# EasyEDA Pro project STM32F103RCT6扩展板.eprj

# Schematic Schematic7
Create Date: 2024-06-12; Page Name: P1; Project Name: 飞协; Schematic Name: Schematic7; Update Date: 2024-06-13; Company: 嘉立创EDA; Page Size: A4; Version: V1.0
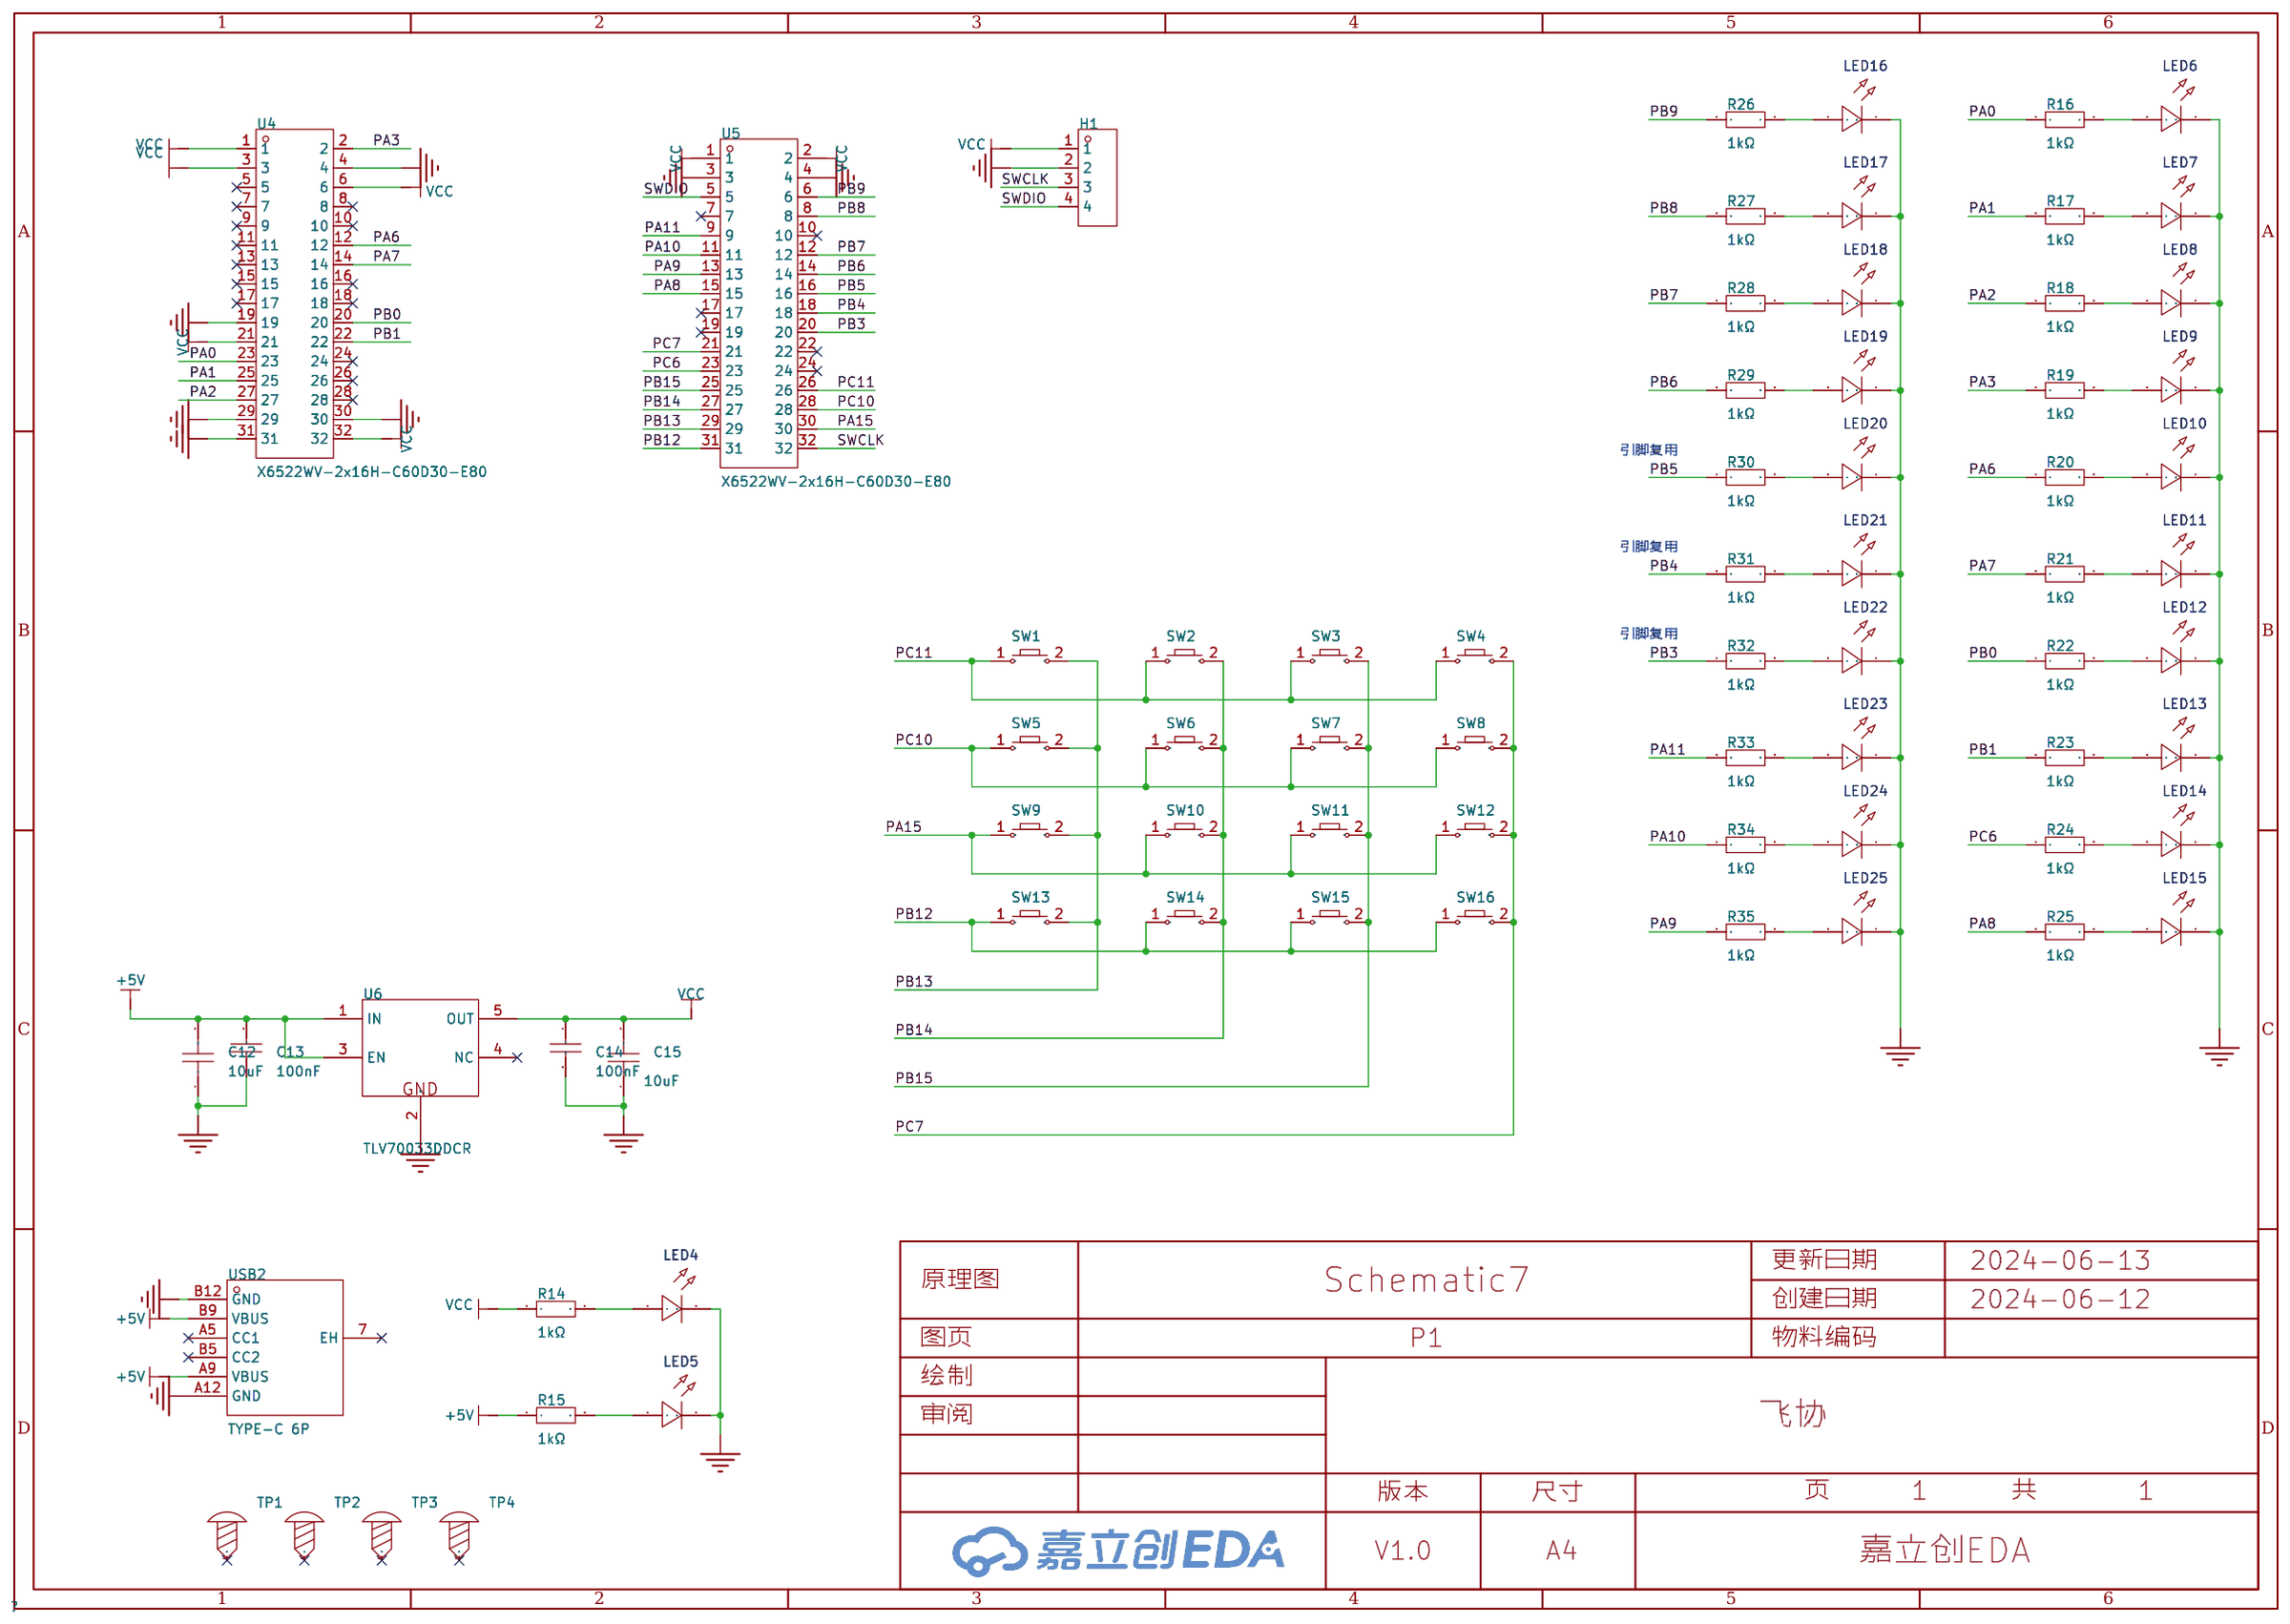
[diagram p0: schematic sheet]

## Parts
C12  10uF  [C0805]
C13  100nF  [C0805]
C14  100nF  [C0805]
C15  10uF  [C0805]
H1  -  [HDR-TH_4P-P2.54-V-F]
LED4  -  [LED_0805]
LED5  -  [LED_0805]
LED6  -  [LED_0805]
LED7  -  [LED_0805]
LED8  -  [LED_0805]
LED9  -  [LED_0805]
LED10  -  [LED_0805]
LED11  -  [LED_0805]
LED12  -  [LED_0805]
LED13  -  [LED_0805]
LED14  -  [LED_0805]
LED15  -  [LED_0805]
LED16  -  [LED_0805]
LED17  -  [LED_0805]
LED18  -  [LED_0805]
LED19  -  [LED_0805]
LED20  -  [LED_0805]
LED21  -  [LED_0805]
LED22  -  [LED_0805]
LED23  -  [LED_0805]
LED24  -  [LED_0805]
LED25  -  [LED_0805]
R14  1kΩ  [R0805]
R15  1kΩ  [R0805]
R16  1kΩ  [R0805]
R17  1kΩ  [R0805]
R18  1kΩ  [R0805]
R19  1kΩ  [R0805]
R20  1kΩ  [R0805]
R21  1kΩ  [R0805]
R22  1kΩ  [R0805]
R23  1kΩ  [R0805]
R24  1kΩ  [R0805]
R25  1kΩ  [R0805]
R26  1kΩ  [R0805]
R27  1kΩ  [R0805]
R28  1kΩ  [R0805]
R29  1kΩ  [R0805]
R30  1kΩ  [R0805]
R31  1kΩ  [R0805]
R32  1kΩ  [R0805]
R33  1kΩ  [R0805]
R34  1kΩ  [R0805]
R35  1kΩ  [R0805]
SW1  -  [Key_SMD_3.6x6.1x2.5]
SW2  -  [Key_SMD_3.6x6.1x2.5]
SW3  -  [Key_SMD_3.6x6.1x2.5]
SW4  -  [Key_SMD_3.6x6.1x2.5]
SW5  -  [Key_SMD_3.6x6.1x2.5]
SW6  -  [Key_SMD_3.6x6.1x2.5]
SW7  -  [Key_SMD_3.6x6.1x2.5]
SW8  -  [Key_SMD_3.6x6.1x2.5]
SW9  -  [Key_SMD_3.6x6.1x2.5]
SW10  -  [Key_SMD_3.6x6.1x2.5]
SW11  -  [Key_SMD_3.6x6.1x2.5]
SW12  -  [Key_SMD_3.6x6.1x2.5]
SW13  -  [Key_SMD_3.6x6.1x2.5]
SW14  -  [Key_SMD_3.6x6.1x2.5]
SW15  -  [Key_SMD_3.6x6.1x2.5]
SW16  -  [Key_SMD_3.6x6.1x2.5]
TP1  -  [M3螺丝]
TP2  -  [M3螺丝]
TP3  -  [M3螺丝]
TP4  -  [M3螺丝]
U4  X6522WV-2x16H-C60D30-E80  [HDR-TH_32P-P2.54-V-M-R2-C16-S2.54-3]
U5  X6522WV-2x16H-C60D30-E80  [HDR-TH_32P-P2.54-V-M-R2-C16-S2.54-3]
U6  TLV70033DDCR  [SOT-23-5_L3.0-W1.7-P0.95-LS2.8-BR]
USB2  TYPE-C 6P  [TYPE-C-SMD_TYPE-C-6P]

## Library data of the parts
C12 C15 = CL21A106KAYNNNE_C15850: 容值:10uF;精度:±10%;额定电压:25V;材质(温度系数):X5R;; LCSC Part Name: 10uF ±10% 25V; Supplier Part: C15850; Manufacturer: SAMSUNG(三星); Manufacturer Part: CL21A106KAYNNNE; Supplier Footprint: 0805; JLCPCB Part Class: 基础库; Datasheet: https://atta.szlcsc.com/upload/public/pdf/source/20160103/1457707679302.pdf; Supplier: LCSC; Tolerance: ±10%; Voltage Rated: 25V; Temperature Coefficient: X5R
C13 C14 = 0805B104K500NT: 容值:100nF;精度:±10%;额定电压:50V;材质(温度系数):X7R;; LCSC Part Name: 100nF ±10% 50V; Supplier Part: C38141; Manufacturer: FH(风华); Supplier Footprint: 0805; JLCPCB Part Class: 扩展库; Datasheet: https://atta.szlcsc.com/upload/public/pdf/source/20200305/C486355_26A10D38EF8C2A5C37091D0039909270.pdf; Supplier: LCSC; Tolerance: ±10%; Voltage Rated: 50V; Temperature Coefficient: X7R
H1 = HDR-F_2.54_1x4P: Supplier Part: C2718488; Supplier Footprint: 插件
LED4-LED25 = LED_0805-B: Supplier Footprint: 0805
R14-R35 = 0805W8F1001T5E: 电阻类型:厚膜电阻;阻值:1kΩ;精度:±1%;功率:125mW;最大工作电压:150V;温度系数:±100ppm/℃;; LCSC Part Name: 1kΩ ±1% 125mW 厚膜电阻; Supplier Part: C17513; Manufacturer: UNI-ROYAL(厚声); Supplier Footprint: 0805; JLCPCB Part Class: 基础库; Datasheet: https://atta.szlcsc.com/upload/public/pdf/source/20200306/C422600_1E6D84923E4A46A82E41ADD87F860B5C.pdf; Supplier: LCSC; Type: 厚膜电阻; Tolerance: ±1%; Power(Watts): 125mW; Overload Voltage (Max): 150V; Temperature Coefficient: ±100ppm/℃; Operating Temperature Range: -55℃~+155℃
SW1-SW16 = Key_SMD_3.6x6.1x2.5: Supplier Footprint: SMD
TP1-TP4 = M3螺丝: Supplier Footprint: 插件
U4 U5 = X6522WV-2x16H-C60D30-E80: 插针结构:2x16P;间距:2.54mm;行距:2.54mm;圆针/方针:方针;安装类型:-;排数:双排;总PIN位数:32P;额定电流:3A;额定电压:250V;配合针长度:6mm;塑高:2.5mm;端接针长度:3mm;触头材质:黄铜;触头镀层:金;工作温度范围:-40℃~+105℃;焊接温度(最大值):260℃;颜色:黑色;; LCSC Part Name: 2x16P 间距:2.54mm 方针; Supplier Part: C5242090; Manufacturer: XKB Connection(中国星坤); Supplier Footprint: 插件,P=2.54mm; JLCPCB Part Class: Extended Part; Datasheet: https://atta.szlcsc.com/upload/public/pdf/source/20221103/23C5907AD205635BEC14B32D152B61D5.pdf; Supplier: LCSC; Pin Structure: 2x16P; Pitch: 2.54mm; Row Spacing: 2.54mm; Circluar Pins/Square Pins: 方针; Number of Rows: 双排; Number of Pins: 32P; Current Rating (Max): 3A; Voltage Rating (Max): 250V; Length of Mating Pin: 6mm; Insulation Height: 2.5mm; Length of End Connection Pin: 3mm; Contact Material: 黄铜; Contact Plating: 金; Operating Temperature Range: -40℃~+105℃; Soldering Temperature(Max): 260℃; Color: 黑色
U6 = TLV70033DDCR: 输出类型:固定;输出极性:正;输出通道数:1;最大输入电压:5.5V;输出电压:3.3V;压差:250mV@(200mA);输出电流:200mA;电源纹波抑制比(PSRR):68dB@(1kHz);; LCSC Part Name: 正 Vin=5.5V Vout=3.3V 200mA 68dB@(1kHz); Supplier Part: C11337; Manufacturer: TI(德州仪器); Supplier Footprint: SOT-23-5; JLCPCB Part Class: 扩展库; Datasheet: https://atta.szlcsc.com/upload/public/pdf/source/20130225/1457706594034.pdf; Supplier: LCSC; Output Type: 固定; Output Polarity: 正; Number of Outputs: 1; Maximum Input Voltage: 5.5V; Output Voltage: 3.3V; Dropout Voltage: 250mV@(200mA); Output Current: 200mA; Power Supply Rejection Ratio (PSRR): 68dB@(1kHz)
USB2 = TYPE-C 6P: 连接器类型:Type-C;标准:-;公母:母;端口数量:1;触点数量:6P;安装方式:卧贴;额定电流 - 电源:-;工作温度范围:-40℃~+85℃;; LCSC Part Name: Type-C 母 卧贴; Supplier Part: C456012; Manufacturer: SHOU HAN(首韩); Supplier Footprint: SMD; JLCPCB Part Class: 扩展库; Datasheet: https://atta.szlcsc.com/upload/public/pdf/source/20201203/C456012_B13F72044DF846EDBE9BDD0D1D3CD166.pdf; Supplier: LCSC; Connector Type: Type-C; Gender: 母; Number of Ports: 1; Number of Contacts: 6P; Mounting Style: 卧贴; Operating Temperature Range: -40℃~+85℃

## Nets
+5V: C12.2 C13.2 R15.1 U6.1(IN) U6.3(EN) USB2.A9(VBUS) USB2.B9(VBUS)
GND: C12.1 C13.1 C14.2 C15.1 H1.2 LED4.1(C) LED5.1(C) LED6.1(C) LED7.1(C) LED8.1(C) LED9.1(C) LED10.1(C) LED11.1(C) LED12.1(C) LED13.1(C) LED14.1(C) LED15.1(C) LED16.1(C) LED17.1(C) LED18.1(C) LED19.1(C) LED20.1(C) LED21.1(C) LED22.1(C) LED23.1(C) LED24.1(C) LED25.1(C) U4.4 U4.19 U4.29 U4.30 U4.31 U5.3 U5.4 U6.2(GND) USB2.A12(GND) USB2.B12(GND)
VCC: C14.1 C15.2 H1.1 R14.1 U4.1 U4.3 U4.6 U4.21 U4.32 U5.1 U5.2 U6.5(OUT)
PA0: R16.1 U4.23
PA1: R17.1 U4.25
PA2: R18.1 U4.27
PA3: R19.1 U4.2
PA6: R20.1 U4.12
PA7: R21.1 U4.14
PA8: R25.1 U5.15
PA9: R35.1 U5.13
PA10: R34.1 U5.11
PA11: R33.1 U5.9
PA15: SW9.1 SW10.1 SW11.1 SW12.1 U5.30
PB0: R22.1 U4.20
PB1: R23.1 U4.22
PB3: R32.1 U5.20
PB4: R31.1 U5.18
PB5: R30.1 U5.16
PB6: R29.1 U5.14
PB7: R28.1 U5.12
PB8: R27.1 U5.8
PB9: R26.1 U5.6
PB12: SW13.1 SW14.1 SW15.1 SW16.1 U5.31
PB13: SW1.2 SW5.2 SW9.2 SW13.2 U5.29
PB14: SW2.2 SW6.2 SW10.2 SW14.2 U5.27
PB15: SW3.2 SW7.2 SW11.2 SW15.2 U5.25
PC6: R24.1 U5.23
PC7: SW4.2 SW8.2 SW12.2 SW16.2 U5.21
PC10: SW5.1 SW6.1 SW7.1 SW8.1 U5.28
PC11: SW1.1 SW2.1 SW3.1 SW4.1 U5.26
SWCLK: H1.3 U5.32
SWDIO: H1.4 U5.5
$1N1146: LED4.2(A) R14.2
$1N1147: LED5.2(A) R15.2
$1N1290: LED6.2(A) R16.2
$1N1291: LED7.2(A) R17.2
$1N1418: LED8.2(A) R18.2
$1N1419: LED9.2(A) R19.2
$1N1552: LED10.2(A) R20.2
$1N1553: LED11.2(A) R21.2
$1N1730: LED12.2(A) R22.2
$1N1731: LED13.2(A) R23.2
$1N1861: LED14.2(A) R24.2
$1N1862: LED15.2(A) R25.2
$1N4308: LED16.2(A) R26.2
$1N4310: LED17.2(A) R27.2
$1N4332: LED18.2(A) R28.2
$1N4334: LED19.2(A) R29.2
$1N4335: LED20.2(A) R30.2
$1N4336: LED21.2(A) R31.2
$1N4356: LED22.2(A) R32.2
$1N4357: LED23.2(A) R33.2
$1N4359: LED24.2(A) R34.2
$1N4361: LED25.2(A) R35.2

Not connected (* = marked no-connect by the designer): TP1 1*; TP2 1*; TP3 1*; TP4 1*; U4 5* 7* 8* 9* 10* 11* 13* 15* 16* 17* 18* 24* 26* 28*; U5 7* 10* 17* 19* 22* 24*; U6 4(NC)*; USB2 7(EH)* A5(CC1)* B5(CC2)*

## Notes on the sheet
- 引脚复用
- 引脚复用
- 引脚复用

# Board PCB26
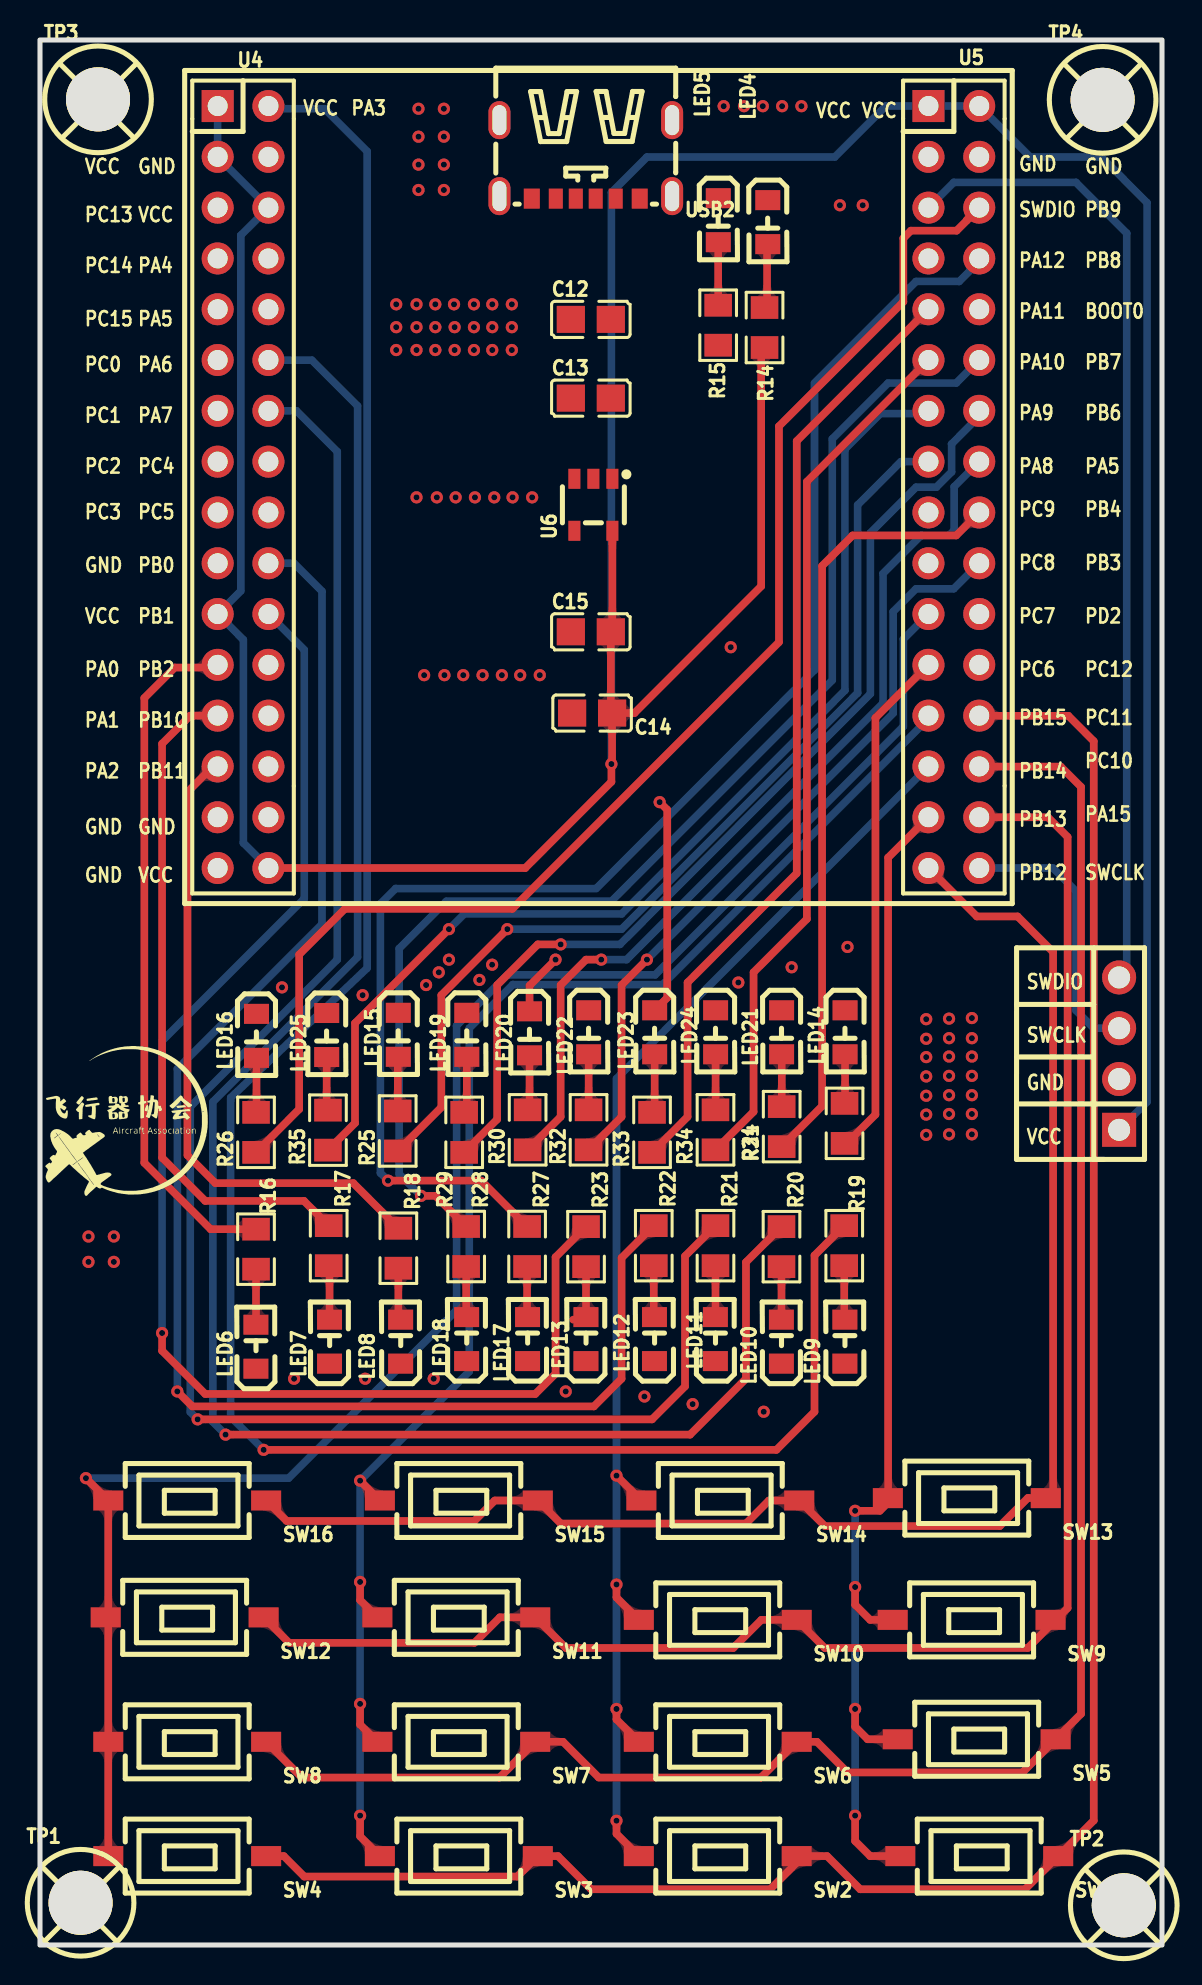
[diagram p1: board, top side]
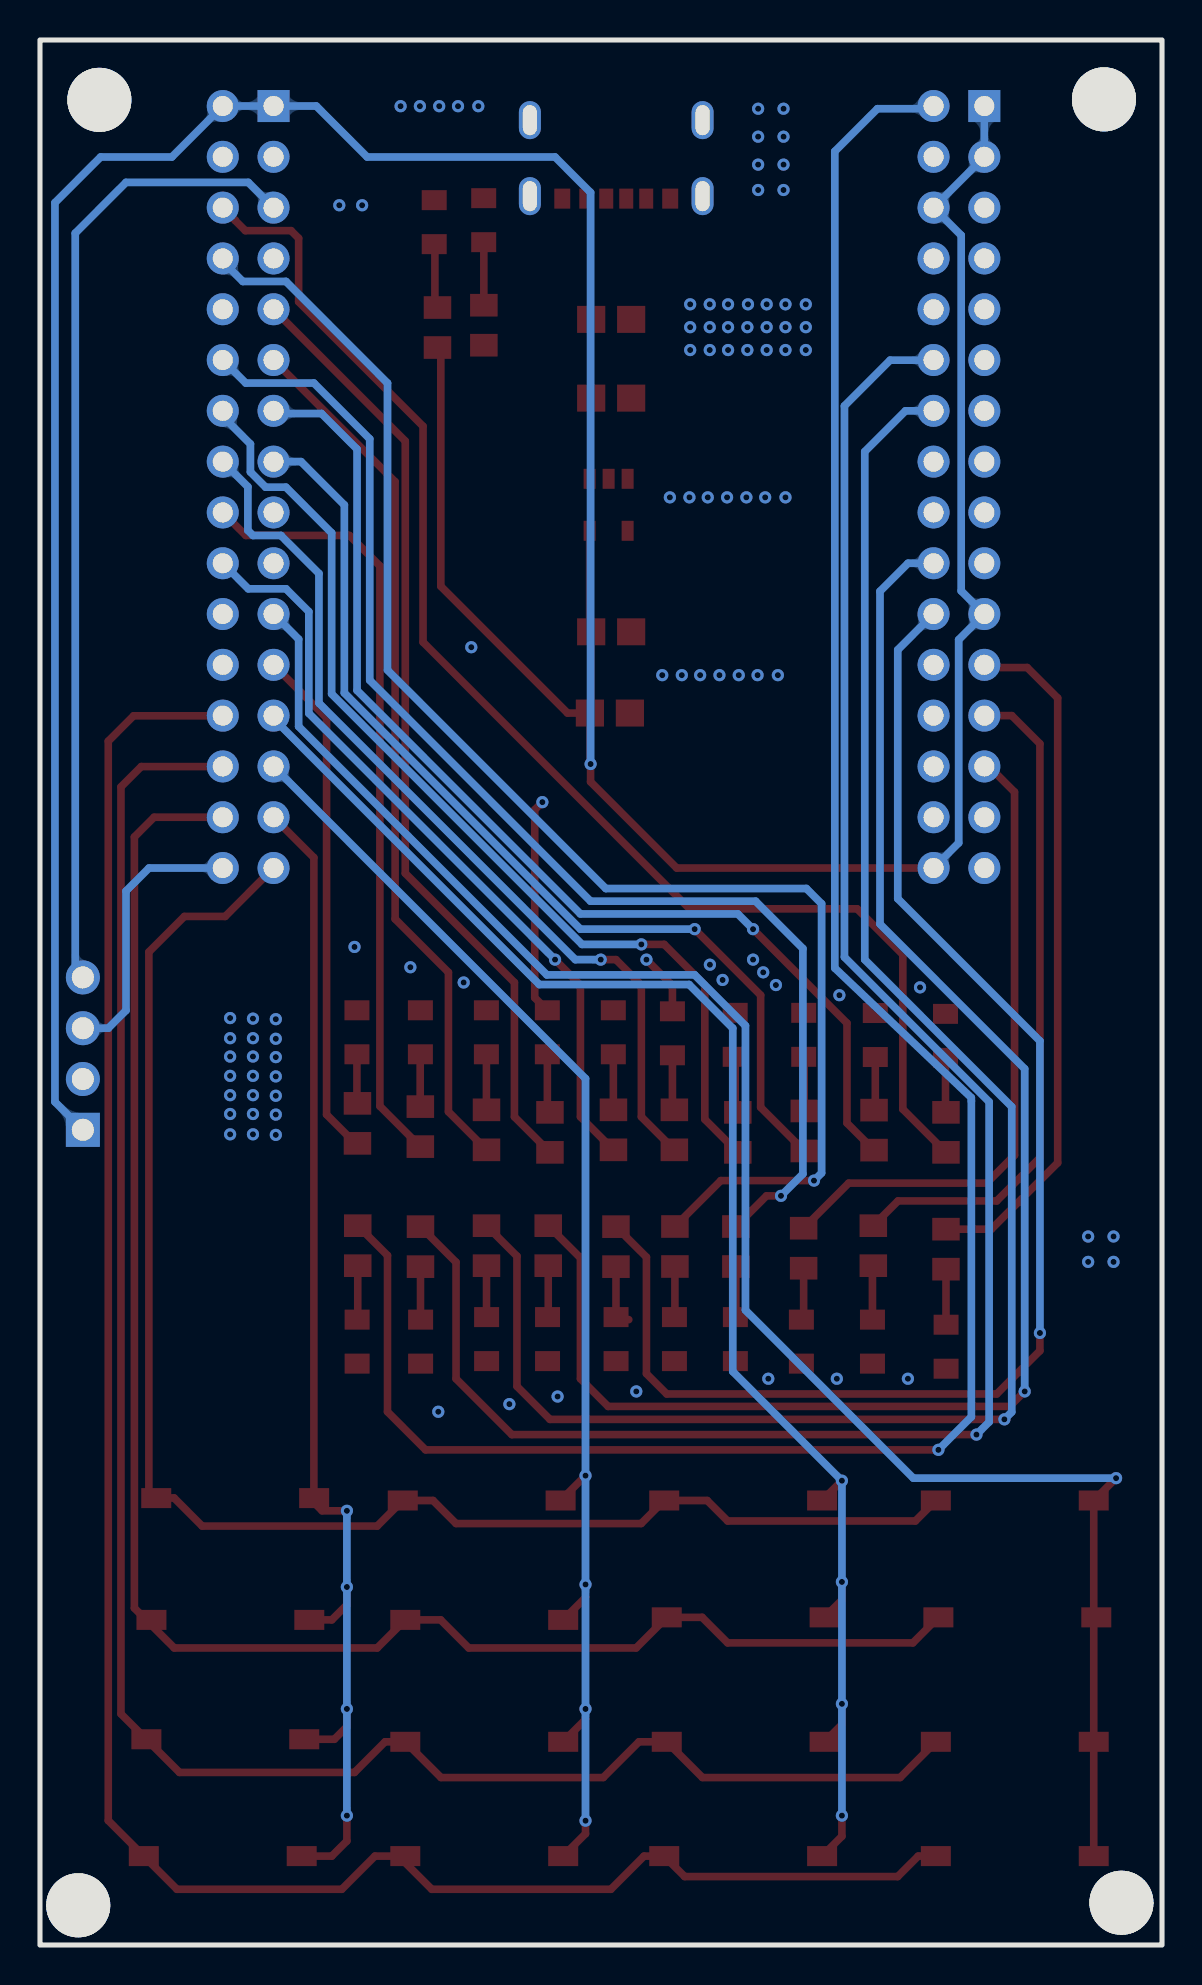
[diagram p2: board, bottom side, seen from below]

Outline 56.13 x 95.25 mm; copper layers: Top Layer, Bottom Layer. Coordinates in mm from the lower left corner of the outline.
Outline path: rectangle 56.13,95.25 0,0
Stack: Top Layer 0.035mm / Dielectric1 1.51mm FR4 er 4.5 / Bottom Layer 0.035mm

## Design rules (mm)
template: 自定义配置
spacing copperThickness1oz (default): track to track 0.102, other pairs 0.152 to 0.3
spacing copperThickness2oz: track to track 0.203, other pairs 0.152 to 0.3
track width copperThickness1oz (default): min 0.127, default 0.254, max 2.54
track width copperThickness2oz: min 0.203, default 0.254, max 2.54
differential pair differentialPair (default): width min 0.127, default 0.254, max 2.54; gap min 0.152, default 0.152
via viaSize (default): diameter min 0.5, default 0.61, max 10; hole min 0.3, default 0.305, max 6.3

## Placement (name value [footprint] x y rotation side)
C12  10uF  [C0805]  27.56 81.28 0 top
C13  100nF  [C0805]  27.56 77.34 0 top
C14  100nF  [C0805]  27.62 61.6 180 top
C15  10uF  [C0805]  27.56 65.66 0 top
H1  -  [HDR-TH_4P-P2.54-V-F]  53.99 44.57 90 top
LED4  -  [LED_0805]  36.41 86.09 270 top
LED5  -  [LED_0805]  33.93 86.19 270 top
LED6  -  [LED_0805]  10.81 29.96 90 top
LED7  -  [LED_0805]  14.49 30.22 90 top
LED8  -  [LED_0805]  18.05 30.22 90 top
LED9  -  [LED_0805]  40.27 30.22 90 top
LED10  -  [LED_0805]  37.1 30.22 90 top
LED11  -  [LED_0805]  33.8 30.35 90 top
LED12  -  [LED_0805]  30.75 30.35 90 top
LED13  -  [LED_0805]  27.32 30.35 90 top
LED14  -  [LED_0805]  40.27 45.59 270 top
LED15  -  [LED_0805]  17.92 45.46 270 top
LED16  -  [LED_0805]  10.83 45.41 270 top
LED17  -  [LED_0805]  24.4 30.35 90 top
LED18  -  [LED_0805]  21.35 30.35 90 top
LED19  -  [LED_0805]  21.35 45.46 270 top
LED20  -  [LED_0805]  24.49 45.53 270 top
LED21  -  [LED_0805]  37.1 45.59 270 top
LED22  -  [LED_0805]  27.45 45.59 270 top
LED23  -  [LED_0805]  30.75 45.59 270 top
LED24  -  [LED_0805]  33.8 45.59 270 top
LED25  -  [LED_0805]  14.34 45.45 270 top
R14  1kΩ  [R0805]  36.25 80.87 90 top
R15  1kΩ  [R0805]  33.93 80.99 90 top
R16  1kΩ  [R0805]  10.81 34.79 270 top
R17  1kΩ  [R0805]  14.44 34.97 270 top
R18  1kΩ  [R0805]  17.93 34.84 270 top
R19  1kΩ  [R0805]  40.24 34.97 270 top
R20  1kΩ  [R0805]  37.1 34.92 270 top
R21  1kΩ  [R0805]  33.8 34.97 270 top
R22  1kΩ  [R0805]  30.71 34.97 270 top
R23  1kΩ  [R0805]  27.32 34.92 270 top
R24  1kΩ  [R0805]  40.25 41.08 90 top
R25  1kΩ  [R0805]  17.9 40.7 90 top
R26  1kΩ  [R0805]  10.81 40.63 90 top
R27  1kΩ  [R0805]  24.37 34.92 270 top
R28  1kΩ  [R0805]  21.32 34.92 270 top
R29  1kΩ  [R0805]  21.22 40.63 90 top
R30  1kΩ  [R0805]  24.4 40.76 90 top
R31  1kΩ  [R0805]  37.11 40.92 90 top
R32  1kΩ  [R0805]  27.45 40.76 90 top
R33  1kΩ  [R0805]  30.62 40.63 90 top
R34  1kΩ  [R0805]  33.8 40.76 90 top
R35  1kΩ  [R0805]  14.41 40.74 90 top
SW1  -  [Key_SMD_3.6x6.1x2.5]  46.99 4.45 180 top
SW2  -  [Key_SMD_3.6x6.1x2.5]  33.91 4.45 180 top
SW3  -  [Key_SMD_3.6x6.1x2.5]  20.95 4.45 180 top
SW4  -  [Key_SMD_3.6x6.1x2.5]  7.37 4.45 180 top
SW5  -  [Key_SMD_3.6x6.1x2.5]  46.86 10.29 180 top
SW6  -  [Key_SMD_3.6x6.1x2.5]  33.91 10.16 180 top
SW7  -  [Key_SMD_3.6x6.1x2.5]  20.83 10.16 180 top
SW8  -  [Key_SMD_3.6x6.1x2.5]  7.37 10.16 180 top
SW9  -  [Key_SMD_3.6x6.1x2.5]  46.61 16.26 180 top
SW10  -  [Key_SMD_3.6x6.1x2.5]  33.91 16.26 180 top
SW11  -  [Key_SMD_3.6x6.1x2.5]  20.83 16.38 180 top
SW12  -  [Key_SMD_3.6x6.1x2.5]  7.24 16.38 180 top
SW13  -  [Key_SMD_3.6x6.1x2.5]  46.37 22.34 180 top
SW14  -  [Key_SMD_3.6x6.1x2.5]  34.04 22.23 180 top
SW15  -  [Key_SMD_3.6x6.1x2.5]  20.95 22.23 180 top
SW16  -  [Key_SMD_3.6x6.1x2.5]  7.37 22.23 180 top
TP1  -  [M3螺丝]  2.1 2.05 0 top
TP2  -  [M3螺丝]  54.28 1.92 0 top
TP3  -  [M3螺丝]  2.97 92.22 0 top
TP4  -  [M3螺丝]  53.23 92.19 0 top
U4  X6522WV-2x16H-C60D30-E80  [HDR-TH_32P-P2.54-V-M-R2-C16-S2.54-3]  10.16 72.9 270 top
U5  X6522WV-2x16H-C60D30-E80  [HDR-TH_32P-P2.54-V-M-R2-C16-S2.54-3]  45.72 72.9 270 top
U6  TLV70033DDCR  [SOT-23-5_L3.0-W1.7-P0.95-LS2.8-BR]  27.69 72.01 90 top
USB2  TYPE-C 6P  [TYPE-C-SMD_TYPE-C-6P]  27.3 89.28 180 top

## Footprints (pads in the part's own frame, mm; a bottom-side part is the same pattern mirrored in y, then rotated)
C0805
  rect 1.41x1.35 smd: 1(-1,0) 2(1,0)
HDR-TH_4P-P2.54-V-F
  rect 1.7x1.7 hole 1.1: 1(-3.81,0)
  round 1.7 hole 1.1: 2(-1.27,0) 3(1.27,0) 4(3.81,0)
HDR-TH_32P-P2.54-V-M-R2-C16-S2.54-3
  rect 1.6x1.6 hole 1: 1(-19.05,-1.27)
  round 1.6 hole 1: 2(-19.05,1.27) 3(-16.51,-1.27) 4(-16.51,1.27) 5(-13.97,-1.27) 6(-13.97,1.27) 7(-11.43,-1.27) 8(-11.43,1.27) 9(-8.89,-1.27) 10(-8.89,1.27) 11(-6.35,-1.27) 12(-6.35,1.27) 13(-3.81,-1.27) 14(-3.81,1.27) 15(-1.27,-1.27) 16(-1.27,1.27) 17(1.27,-1.27) 18(1.27,1.27) 19(3.81,-1.27) 20(3.81,1.27) 21(6.35,-1.27) 22(6.35,1.27) 23(8.89,-1.27) 24(8.89,1.27) 25(11.43,-1.27) 26(11.43,1.27) 27(13.97,-1.27) 28(13.97,1.27) 29(16.51,-1.27) 30(16.51,1.27) 31(19.05,-1.27) 32(19.05,1.27)
Key_SMD_3.6x6.1x2.5
  rect 1.501x1.001 smd: 1(-3.95,0) 2(3.95,0)
LED_0805
  rect 1x1.25 smd: 1(-1.15,0.005) 2(1.05,0.005)
M3螺丝
  round 3.2 hole 3.2: 1(-0.064,0.064)
R0805
  rect 1.133x1.377 smd: 1(-1,0) 2(1,0)
SOT-23-5_L3.0-W1.7-P0.95-LS2.8-BR
  rect 1x0.6 smd: 1(1.3,-0.95) 2(1.3,0) 3(1.3,0.95) 4(-1.3,0.95) 5(-1.3,-0.95)
TYPE-C-SMD_TYPE-C-6P
  oval 1.1x1.9 hole 0.7x1.5: 7(-4.32,1.837) 7(-4.32,-1.962) 7(4.32,1.837) 7(4.32,-1.962)
  rect 0.7x1 smd: A5(-0.5,1.962) A9(1.5,1.962) B5(0.5,1.962) B9(-1.5,1.962)
  rect 0.8x1 smd: A12(2.7,1.962) B12(-2.7,1.962)

## Nets
As in the schematic.

Pads without a net: TP1 1; TP2 1; TP3 1; TP4 1; U4 5 7 8 9 10 11 13 15 16 17 18 24 26 28; U5 7 10 17 19 22 24; U6 4; USB2 7 A5 B5

## Via types
v1: diameter 0.61, hole 0.305, Top Layer to Bottom Layer, 121 vias

## Routing (per net, layer and track width the routed paths; a pad name or vN(x,y) marks a point on that pad's centre or on a via; arc(x,y) is an arc through that point)
GND: length 13.9
  Top Layer w0.381: v1(31,57.14) 31.38,56.76 31.38,47.37 LED23.1 ; LED20.1 24.49,47.97 v1(25.79,49.27)
  vias: v1(2.43,35.43) v1(2.43,34.16) v1(3.7,35.43) v1(3.7,34.16) v1(12.11,47.88) v1(12.71,28.31) v1(16.14,47.49) v1(16.27,28.31) v1(17.82,82.03) v1(17.82,80.89) v1(17.82,79.75) v1(18.84,82.03) v1(18.84,80.89) v1(18.84,79.75) v1(18.84,72.38) v1(18.94,91.81) v1(18.94,90.42) v1(18.94,89.02) v1(18.94,87.75) v1(19.22,63.49) v1(19.32,48) v1(19.78,82.03) v1(19.78,80.89) v1(19.78,79.75) v1(19.7,28.31) v1(19.85,72.38) v1(19.95,48.63) v1(20.21,91.81) v1(20.21,90.42) v1(20.21,89.02) v1(20.21,87.75) v1(20.23,63.49) v1(20.46,49.27) v1(20.71,82.03) v1(20.74,80.89) v1(20.74,79.75) v1(20.8,72.38) v1(21.18,63.49) v1(21.71,82.03) v1(21.71,80.89) v1(21.71,79.75) v1(21.76,72.38) v1(21.98,48.25) v1(22.14,63.49) v1(22.63,82.03) v1(22.63,80.89) v1(22.63,79.75) v1(22.62,49.01) v1(22.73,72.38) v1(23.11,63.49) v1(23.61,82.03) v1(23.61,80.89) v1(23.61,79.75) v1(23.64,72.38) v1(24.02,63.49) v1(24.62,72.38) v1(25,63.49) v1(26.3,27.68) v1(30.24,27.42) v1(32.65,27.04) v1(34.2,91.94) v1(34.56,64.89) v1(34.94,48.13) v1(35.22,91.94) v1(36.16,91.94) v1(36.21,26.66) v1(37.13,91.94) v1(37.61,48.89) v1(38.09,91.94) v1(40.02,86.99) v1(40.4,49.9) v1(41.16,86.99) v1(44.34,46.29) v1(44.34,45.31) v1(44.34,44.4) v1(44.34,43.43) v1(44.34,42.46) v1(44.34,41.52) v1(44.34,40.51) v1(45.48,46.32) v1(45.48,45.34) v1(45.48,44.42) v1(45.48,43.46) v1(45.48,42.49) v1(45.48,41.55) v1(45.48,40.53) v1(46.62,46.35) v1(46.62,45.34) v1(46.62,44.42) v1(46.62,43.46) v1(46.62,42.49) v1(46.62,41.55) v1(46.62,40.53)
VCC: length 200.6
  Top Layer w0.381: C14.1 28.62,59.08 v1(28.59,59.05) 28.59,58.16 24.28,53.85 U4.32 ; C14.1 28.56,61.66 C15.2 28.64,65.74 U6.5 ; C14.1 29.74,61.6 36.08,67.94 36.08,79.49
  Bottom Layer w0.381: U4.1 U4.3 U4.6 10.05,85.48 10.05,67.7 U4.21 10.17,65.26 10.17,55.1 U4.32 ; v1(28.59,59.05) 28.59,87.62 30.37,89.4 39.76,89.4 42.31,91.95 U5.1 U5.2 49.54,89.4 53.1,89.4 55.39,87.11 55.39,42.16 H1.1
PA0: length 34.6
  Top Layer w0.381: U4.23 8.76,63.87 6.74,63.87 5.22,62.35 5.22,39.11 8.54,35.79 R16.1
PA1: length 33.8
  Top Layer w0.381: U4.25 7.51,61.47 6.11,60.06 6.11,39.36 8.27,37.2 13.21,37.2 R17.1
PA2: length 32.3
  Top Layer w0.381: R18.1 15.68,38.09 8.78,38.09 7.38,39.49 7.38,57.65 8.66,58.93 U4.27
PA3: length 112.7
  Top Layer w0.381: R19.1 38.75,34.48 38.75,26.66 36.84,24.76 v1(11.19,24.76)
  Bottom Layer w0.381: v1(11.19,24.76) 9.54,26.41 9.54,42.2 9.54,42.37 16.37,48.85 16.37,89.68 14.24,91.81 11.56,91.81 U4.2
PA6: length 95.6
  Top Layer w0.381: R20.1 35.32,34.14 35.32,28.31 32.53,25.52 v1(9.28,25.52)
  Bottom Layer w0.381: U4.12 11.44,79.24 13.6,79.24 15.89,76.95 15.89,49.4 8.65,42.16 8.65,26.15 v1(9.28,25.52)
PA7: length 89.6
  Top Layer w0.381: R21.1 32.27,34.44 32.27,27.93 30.62,26.28 v1(7.89,26.28)
  Bottom Layer w0.381: v1(7.89,26.28) 7.52,26.65 7.52,41.92 14.87,49.27 14.87,74.67 12.83,76.71 U4.14
PA8: length 49.6
  Top Layer w0.381: R25.1 20.08,41.88 20.08,47.49 v1(23.38,50.79)
  Bottom Layer w0.381: U5.15 43.07,74.17 40.91,72 40.91,62.6 29.1,50.79 v1(23.38,50.79)
PA9: length 55.3
  Top Layer w0.381: v1(20.46,50.79) 15.76,46.09 15.76,41.1 R35.1
  Bottom Layer w0.381: v1(20.46,50.79) 21.22,51.55 29.1,51.55 40.27,62.73 40.27,74.8 42.05,76.57 44.32,76.57 U5.13
PA10: length 43.9
  Top Layer w0.381: R34.1 35.7,41.66 35.7,48.63 38.37,51.3 38.37,73.17 U5.11
PA11: length 47.9
  Top Layer w0.381: U5.9 37.86,75.2 37.86,53.59 32.4,48.13 32.4,41.41 R33.1
PA15: length 87.3
  Top Layer w0.381: SW12.1 12.47,15.11 21.73,15.11 23.01,16.38 SW11.1 26.31,14.85 34.68,14.85 36.09,16.26 SW10.1 39.26,14.85 49.42,14.85 51.41,16.85 51.41,55.4 50.42,56.39 U5.30
PB0: length 77.7
  Top Layer w0.381: R22.1 29.1,34.36 29.1,28.31 27.71,26.93 7.62,26.93 v1(6.87,27.68)
  Bottom Layer w0.381: U4.20 12.71,69.09 14.11,67.68 14.11,51.05 6.87,43.81 v1(6.87,27.68)
PB1: length 69.5
  Top Layer w0.381: v1(6.11,30.6) 6.11,29.71 8.27,27.55 24.78,27.55 25.79,28.57 25.79,34.39 R23.1
  Bottom Layer w0.381: v1(6.11,30.6) 6.11,45.2 13.22,52.32 13.22,64.76 U4.22
PB3: length 38.5
  Top Layer w0.381: R32.1 29.1,41.41 29.1,48 v1(30.37,49.27)
  Bottom Layer w0.381: v1(30.37,49.27) 42.69,61.59 42.69,66.67 43.83,67.81 45.71,67.81 U5.20
PB4: length 38.8
  Top Layer w0.381: U5.18 45.84,70.48 40.65,70.48 39.13,68.95 39.13,41.94 R31.1
PB5: length 45.8
  Top Layer w0.381: v1(28.08,49.27) 27.32,49.27 26.05,48 26.05,41.41 R30.1
  Bottom Layer w0.381: v1(28.08,49.27) 29.35,49.27 42.18,62.1 42.18,68.57 44.08,70.48 45.48,70.48 45.73,70.73 45.73,72.91 U5.16
PB6: length 50.8
  Top Layer w0.381: R29.1 22.87,41.28 22.87,48 24.91,50.03 v1(26.05,50.03)
  Bottom Layer w0.381: v1(26.05,50.03) 29.02,50.03 41.54,62.56 41.54,70.6 43.83,72.89 44.84,72.89 45.61,73.65 45.61,75.05 46.99,76.43 U5.14
PB7: length 64
  Top Layer w0.381: v1(19.06,37.46) 19.79,37.46 R28.1
  Bottom Layer w0.381: v1(19.06,37.46) 17.97,38.55 17.97,49.82 20.33,52.19 28.59,52.19 39.64,63.24 39.64,75.3 42.43,78.1 45.84,78.1 U5.12
PB8: length 73.7
  Top Layer w0.381: R27.1 22.07,38.22 v1(17.41,38.22)
  Bottom Layer w0.381: v1(17.41,38.22) 17.03,38.6 17.03,52.06 17.79,52.82 27.83,52.82 38.75,63.75 38.75,78.1 43.83,83.18 45.99,83.18 46.99,84.18 U5.8
PB9: length 68.5
  Top Layer w0.381: U5.6 46.37,86.25 46.37,86.23 45.86,85.72 43.57,85.72 43.19,85.34 43.19,82.16 36.97,75.94 36.97,65.14 23.64,51.81 15.25,51.81 12.97,49.52 12.97,41.79 R26.1
PB12: length 77.3
  Top Layer w0.381: U5.31 46.87,51.43 48.91,51.43 50.69,49.65 50.69,22.73 50.31,22.35 49.42,22.35 48.02,20.95 39.26,20.95 SW14.1 36.47,22.23 35.32,21.07 26.06,21.07 SW15.1 22.75,22.23 21.73,21.2 12.34,21.2 SW16.1
PB13: length 62.4
  Top Layer w0.381: SW9.2 41.53,16.26 40.78,17.01 v1(40.78,17.9) ; SW1.2 41.53,4.45 40.78,5.2 v1(40.78,6.47) ; v1(40.78,21.71) 42.02,21.71 42.43,22.12 42.43,54.37 U5.29 ; v1(40.78,11.8) 40.78,10.91 41.41,10.29 SW5.2
  Bottom Layer w0.381: v1(40.78,21.71) v1(40.78,17.9) v1(40.78,11.8) v1(40.78,6.47)
PB14: length 67.5
  Top Layer w0.381: v1(28.84,6.22) 28.84,5.56 SW2.2 ; v1(28.84,11.8) 28.84,11.28 SW6.2 ; SW10.2 28.84,17.37 v1(28.84,18.03) ; 28.84,23.49 v1(28.84,23.47) SW14.2
  Bottom Layer w0.381: v1(28.84,6.22) v1(28.84,11.8) v1(28.84,18.03) v1(28.84,23.47) 28.84,43.32 U5.27
PB15: length 79.4
  Top Layer w0.381: v1(16.02,18.15) 16.02,17.25 SW11.2 ; SW7.2 16.02,11.02 v1(16.02,12.06) ; SW15.2 v1(16.02,23.22) 16.02,23.23 ; SW3.2 16.02,5.44 v1(16.02,6.47)
  Bottom Layer w0.381: v1(16.02,6.47) v1(16.02,12.06) v1(16.02,18.15) v1(16.02,23.22) 21.48,28.68 21.48,45.84 23.66,48.02 31.15,48.02 44.45,61.32 U5.25
PC6: length 25.7
  Top Layer w0.381: U5.23 41.8,61.35 41.8,41.52 40.36,40.08 R24.1
PC7: length 90.3
  Top Layer w0.381: 2.3,23.36 v1(2.3,23.34) SW16.2 SW8.2 SW4.2
  Bottom Layer w0.381: U5.21 43.19,65.29 43.19,60.93 30.77,48.51 23.38,48.51 20.84,45.97 20.84,31.74 12.44,23.34 v1(2.3,23.34)
PC10: length 97.4
  Top Layer w0.381: U5.28 47,58.92 51.07,58.92 52.08,57.9 52.08,11.56 SW5.1 49.15,8.63 40.4,8.63 38.87,10.16 SW6.1 36.07,8.37 27.95,8.37 26.17,10.16 SW7.1 22.99,8.37 13.1,8.37 SW8.1
PC11: length 106.3
  Top Layer w0.381: 38.19,4.45 36.53,2.79 27.57,2.79 25.91,4.45 SW3.1 23.88,3.42 13.22,3.42 12.2,4.45 SW4.1 ; 38.19,4.45 39.38,4.45 41.03,2.79 49.28,2.79 SW1.1 52.72,6.22 52.72,60.19 51.45,61.46 47,61.46 U5.26 ; 38.19,4.45 SW2.1
SWCLK: length 13.8
  Bottom Layer w0.381: H1.3 52.72,45.84 51.83,46.73 51.83,52.7 50.68,53.85 U5.32
SWDIO: length 48.8
  Bottom Layer w0.381: 54.62,48.38 54.37,48.63 54.37,85.59 51.83,88.13 45.71,88.13 U5.5
$1N1146: length 3.2
  Top Layer w0.381: 36.41,85.04 36.38,85.01 36.38,81.87
$1N1147: length 3.2
  Top Layer w0.381: R15.2 33.93,85.14 LED5.2
$1N1290: length 2.8
  Top Layer w0.381: R16.2 10.81,31.02 LED6.2
$1N1291: length 2.7
  Top Layer w0.381: 14.19,33.84 14.23,33.8 ; 14.49,33.93 14.49,31.27
$1N1418: length 2.7
  Top Layer w0.381: 18.04,31.14 17.93,31.25 R18.2
$1N1419: length 2.7
  Top Layer w0.381: 40.27,31.27 40.24,31.3 R19.2
$1N1552: length 2.7
  Top Layer w0.381: R20.2 37.1,31.27 37.09,31.27
$1N1553: length 2.6
  Top Layer w0.381: R21.2 33.8,31.4 LED11.2
$1N1730: length 2.6
  Top Layer w0.381: LED12.2 30.71,31.43 R22.2
$1N1731: length 2.5
  Top Layer w0.381: 26.68,31.27 26.68,31.27 ; 27.32,31.4 R23.2
$1N1861: length 2.6
  Top Layer w0.381: R24.2 40.28,42.11 40.28,44.66
$1N1862: length 2.6
  Top Layer w0.381: 17.9,44.27 17.9,41.71 R25.2
$1N4308: length 2.7
  Top Layer w0.381: LED16.2 10.83,41.66 R26.2
$1N4310: length 2.5
  Top Layer w0.381: LED17.2 24.37,31.42 R27.2
$1N4332: length 2.5
  Top Layer w0.381: R28.2 21.32,31.42
$1N4334: length 3
  Top Layer w0.381: R29.2 21.35,41.76 21.35,44.54
$1N4335: length 2.8
  Top Layer w0.381: R30.2 24.49,41.86 LED20.2
$1N4336: length 2.8
  Top Layer w0.381: 37.11,44.74 37.11,41.92 R31.2
$1N4356: length 2.9
  Top Layer w0.381: 27.45,44.66 27.45,41.76 R32.2
$1N4357: length 3.1
  Top Layer w0.381: R33.2 30.75,41.76 30.75,44.66
$1N4359: length 2.9
  Top Layer w0.381: R34.2 33.8,41.76 33.8,44.66
$1N4361: length 2.7
  Top Layer w0.381: R35.2 14.34,41.81 LED25.2

## Copper pours and planes (outline as drawn; the poured copper is in the pictures)
+5V on Top Layer: 25.29,87.88 25.29,85.34 25.54,85.08 27.19,85.08 27.7,84.32 27.7,81.53 27.95,81.28 29.61,81.28 29.86,81.53 29.86,86.1 29.35,86.61 29.35,87.88 29.1,88.13 25.54,88.13
+5V on Top Layer: 27.79,81.02 27.56,80.78 27.56,75.61 27.05,74.86 26.37,74.86 26.18,74.67 26.18,72.64 26.43,72.38 26.94,72.38 27.19,72.64 27.19,73.78 27.32,73.91 27.95,73.91 28.08,73.78 28.08,72.76 28.33,72.51 29.01,72.51 29.24,72.74 29.24,75.39 29.34,75.49 33.85,75.49 34.94,76.57 34.94,80.38 34.3,81.02
GND on Top Layer: 4.71,100.83 -0.11,100.83 -4.18,96.77 -4.18,-3.82 -2.78,-5.21 57.42,-5.21 65.42,2.79 65.42,92.96 57.8,100.58 4.46,100.58
GND on Bottom Layer: 0.01,103.12 -12.43,90.67 -12.43,-5.09 -3.8,-13.72 61.35,-13.72 74.69,-0.39 74.69,95.5 67.07,103.12

Small or netless copper shapes (teardrops, artwork), in the pictures only: 151 on Top Layer, 61 on Bottom Layer

## Text on the board
Top Silkscreen Layer: VCC | PC13 | PC14 | PC15 | PC0 | PC1 | PC2 | PC3 | GND | PA0 | PA1 | PA2 | PA4 | PA5 | PA6 | PA7 | PC4 | PC5 | PB0 | PB1 | PB2 | PB10 | PB11 | PA3 | SWDIO | PA12 | PA11 | PA10 | PA9 | PA8 | PC9 | PC8 | PC7 | PC6 | PB15 | PB14 | PB13 | PB12 | SWCLK | PB9 | PB8 | BOOT0 | PB7 | PB6 | PB4 | PB3 | PD2 | PC12 | PC11 | PC10 | PA15
